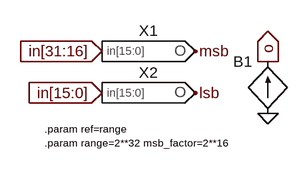
[diagram p0: schematic dac-32bit-fast.asc]
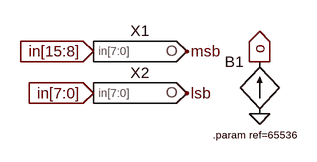
[diagram p1: sub-circuit dac-16bit-fast.asc]
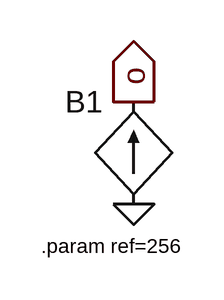
[diagram p2: sub-circuit dac-8bit-fast.asc]
dac-32bit-fast.asc, the LTspice schematic file:
Version 4
SHEET 1 880 680
FLAG 224 -48 o
IOPIN 224 -48 Out
FLAG 224 32 0
FLAG -32 -64 in[31:16]
IOPIN -32 -64 In
FLAG -32 0 in[15:0]
IOPIN -32 0 In
FLAG 112 -64 msb
FLAG 112 0 lsb
SYMBOL bi 224 32 R180
WINDOW 0 24 80 Left 2
WINDOW 3 24 0 Invisible 0
SYMATTR InstName B1
SYMATTR Value I=V(msb)*{msb_factor}+V(lsb)
SYMATTR Value2 Rpar={ref/range}
SYMBOL dac-16bit-fast 32 -64 R0
SYMATTR InstName X1
SYMBOL dac-16bit-fast 32 0 R0
SYMATTR InstName X2
TEXT -120 56 Left 1 !.param ref=range\n.param range=2**32 msb_factor=2**16

dac-16bit-fast.asc, the sub-circuit schematic file:
Version 4
SHEET 1 880 680
FLAG 224 -48 o
IOPIN 224 -48 Out
FLAG 224 32 0
FLAG -32 -64 in[15:8]
IOPIN -32 -64 In
FLAG -32 0 in[7:0]
IOPIN -32 0 In
FLAG 112 -64 msb
FLAG 112 0 lsb
SYMBOL bi 224 32 R180
WINDOW 0 24 80 Left 2
WINDOW 3 24 0 Invisible 0
SYMATTR InstName B1
SYMATTR Value I=V(msb)*256+V(lsb)
SYMATTR Value2 Rpar={ref/65536}
SYMBOL dac-8bit-fast 32 -64 R0
SYMATTR InstName X1
SYMBOL dac-8bit-fast 32 0 R0
SYMATTR InstName X2
TEXT 152 64 Left 1 !.param ref=65536

dac-8bit-fast.asc, the sub-circuit schematic file:
Version 4
SHEET 1 880 680
FLAG 224 -48 o
IOPIN 224 -48 Out
FLAG 224 32 0
SYMBOL bi 224 32 R180
WINDOW 0 24 80 Left 2
WINDOW 3 24 0 Invisible 0
SYMATTR InstName B1
SYMATTR Value I=128*V(in[7])+64*V(in[6])+32*V(in[5])+16*V(in[4])+8*V(in[3])+4*V(in[2])+2*V(in[1])+V(in[0])
SYMATTR Value2 Rpar={ref/256}
TEXT 152 64 Left 1 !.param ref=256

The netlist it stands for:
* dac-32bit-fast.asc
B1 0 o I=V(msb)*{msb_factor}+V(lsb) Rpar={ref/range}
XX1 in[31] in[30] in[29] in[28] in[27] in[26] in[25] in[24] in[23] in[22] in[21] in[20] in[19] in[18] in[17] in[16] msb dac-16bit-fast
XX2 in[15] in[14] in[13] in[12] in[11] in[10] in[9] in[8] in[7] in[6] in[5] in[4] in[3] in[2] in[1] in[0] lsb dac-16bit-fast

* block symbol definitions
.subckt dac-16bit-fast in[15] in[14] in[13] in[12] in[11] in[10] in[9] in[8] in[7] in[6] in[5] in[4] in[3] in[2] in[1] in[0] o
B1 0 o I=V(msb)*256+V(lsb) Rpar={ref/65536}
XX1 in[15] in[14] in[13] in[12] in[11] in[10] in[9] in[8] msb dac-8bit-fast
XX2 in[7] in[6] in[5] in[4] in[3] in[2] in[1] in[0] lsb dac-8bit-fast
.param ref=65536
.ends dac-16bit-fast

.subckt dac-8bit-fast in[7] in[6] in[5] in[4] in[3] in[2] in[1] in[0] o
B1 0 o I=128*V(in[7])+64*V(in[6])+32*V(in[5])+16*V(in[4])+8*V(in[3])+4*V(in[2])+2*V(in[1])+V(in[0]) Rpar={ref/256}
.param ref=256
.ends dac-8bit-fast

.param ref=range
.param range=2**32 msb_factor=2**16
.backanno
.end